# EAGLE design MAX9924_A2_MODE_schematic (EAGLE 7.7.0)
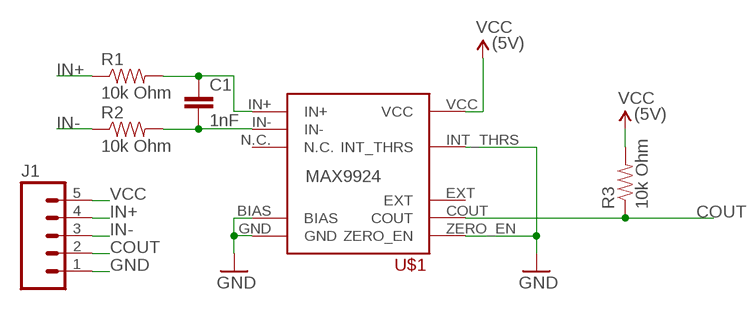
[diagram p0: schematic, sheet 1]

## Parts
C1  1nF  CAPPTH  [CAP-PTH-SMALL]
J1  M05PTH  [1X05]
R1  10k Ohm  RESISTORPTH-1/4W  [AXIAL-0.4]
R2  10k Ohm  RESISTORPTH-1/4W  [AXIAL-0.4]
R3  10k Ohm  RESISTORPTH-1/4W  [AXIAL-0.4]
U$1  MAX9924  [MAX9924]

## Nets
COUT: J1.2 R3.P$1 U$1.COUT
GND: J1.1 U$1.BIAS U$1.GND U$1.INT_THRS U$1.ZERO_EN
IN+: J1.4 R1.P$1
IN-: J1.3 R2.P$1
N$1: C1.2 R2.P$2 U$1.IN-
N$2: C1.1 R1.P$2 U$1.IN+
VCC: J1.5 R3.P$2 U$1.VCC
Unconnected: U$1.EXT U$1.N.C.

## Notes on the sheet
- (5V)
- (5V)

## Library data of the parts
C1 = SparkFun-Capacitors:CAP: Capacitor Standard 0603 ceramic capacitor, and 0.1" leaded capacitor.
J1 = SparkFun-Connectors:M05: Header 5 Standard 5-pin 0.1" header. Use with straight break away headers (SKU : PRT-00116), right angle break away headers (PRT-00553), swiss pins (PRT-00743), machine pins (PRT-00117), and female headers (PRT-00115). Molex polarized connector foot print use with SKU : PRT-08230 with associated crimp pins and housings.
R1-R3 = SparkFun-Resistors:RESISTOR: Resistor Basic schematic elements and footprints for 0603, 1206, and PTH resistors.
U$1 = MAX9924:MAX9924: MAX9924 variable reluctance sensor

## Board
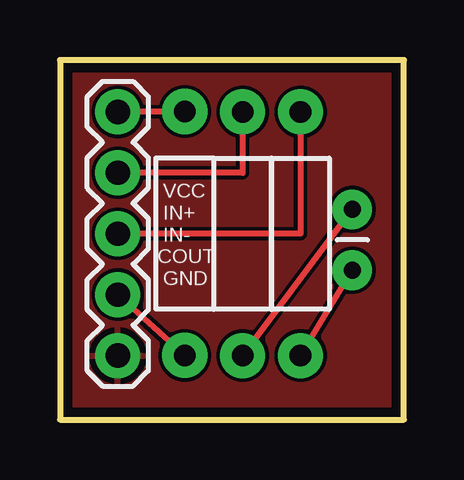
[diagram p1: board, top side]
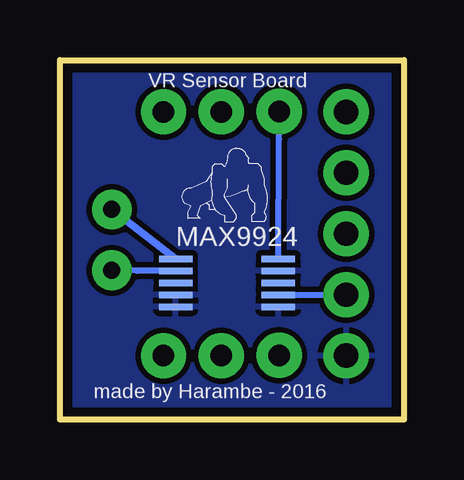
[diagram p2: board, bottom side, seen from below]

Size 14.35 x 14.99 mm. Coordinates in mm from the lower left corner, seen from the top.
Outline: 0,0 14.35,0 14.35,14.99 0,14.99 0,0
Copper layers (1*16): Top 0.0356mm / dielectric 1.5011mm / Bottom 0.0356mm
Design rules "oshpark-2layer": minimum track width 6mil, minimum drill 13mil, track to track 6mil, track to pad 6mil, pad to pad 6mil, via to via 6mil, smd to smd 6mil, copper to edge 15mil, drill to drill 6mil, minimum pad ring 7mil, minimum via ring 7mil, stop-mask expansion 2.5mil, vias tented up to drill 0mil, thermal gap 10mil

### Footprints (pad centres in the part's own frame; a part is rotated, then mirrored left to right if it is on the bottom)
CAP-PTH-SMALL = drill 0.7 pad 1.651: 1 0,0; 2 2.54,0
1X05 = drill 1.016 pad 1.88: 1 0,0; 2 2.54,0; 3 5.08,0; 4 7.62,0; 5 10.16,0
AXIAL-0.4 = drill 0.9 pad 1.88: P$1 -5.08,0; P$2 5.08,0
MAX9924 = smd 1.4 x 0.28: BIAS 0,0.5; COUT 4.28,0.5; EXT 4.28,1; GND 0,0; IN+ 0,2; IN- 0,1.5; INT_THRS 4.28,1.5; N.C. 0,1; VCC 4.28,2; ZERO_EN 4.28,0

### Placement (x,y rotation side)
C1  12.19,8.76 270 top
J1  2.41,2.67 90 top
R1  7.62,7.75 270 top
R2  10.03,7.75 270 top
R3  5.21,7.76 90 top
U$1  9.53,4.7 0 bottom

### Tracks (layer width: path | path; a pad name or v marks a point on that pad's centre or on a via)
COUT
  Top 0.254: J1.2 R3.P$1
  Bottom 0.254: U$1.COUT J1.2
GND
  pour Bottom (isolate 0.229): 0,0 14.35,0 14.35,14.99 0,14.99
  pour Top: 0,0 14.35,0 14.35,14.99 0,14.99
IN+
  Top 0.254: R1.P$1 7.62,10.29 J1.4
IN-
  Top 0.254: R2.P$1 10.03,7.75 J1.3
N$1
  Top 0.254: R2.P$2 C1.2
  Bottom 0.254: U$1.IN- 11.15,6.2 C1.2
N$2
  Top 0.254: R1.P$2 C1.1
  Bottom 0.305: U$1.IN+ C1.1
VCC
  Top 0.254: R3.P$2 J1.5
  Bottom 0.254: U$1.VCC 5.21,11.68 R3.P$2

### Text on the board
tPlace: VCC / IN+ / IN- / COUT / GND
bPlace: VR Sensor Board | made by Harambe - 2016